# EAGLE design polargraph (EAGLE 9.3.0)
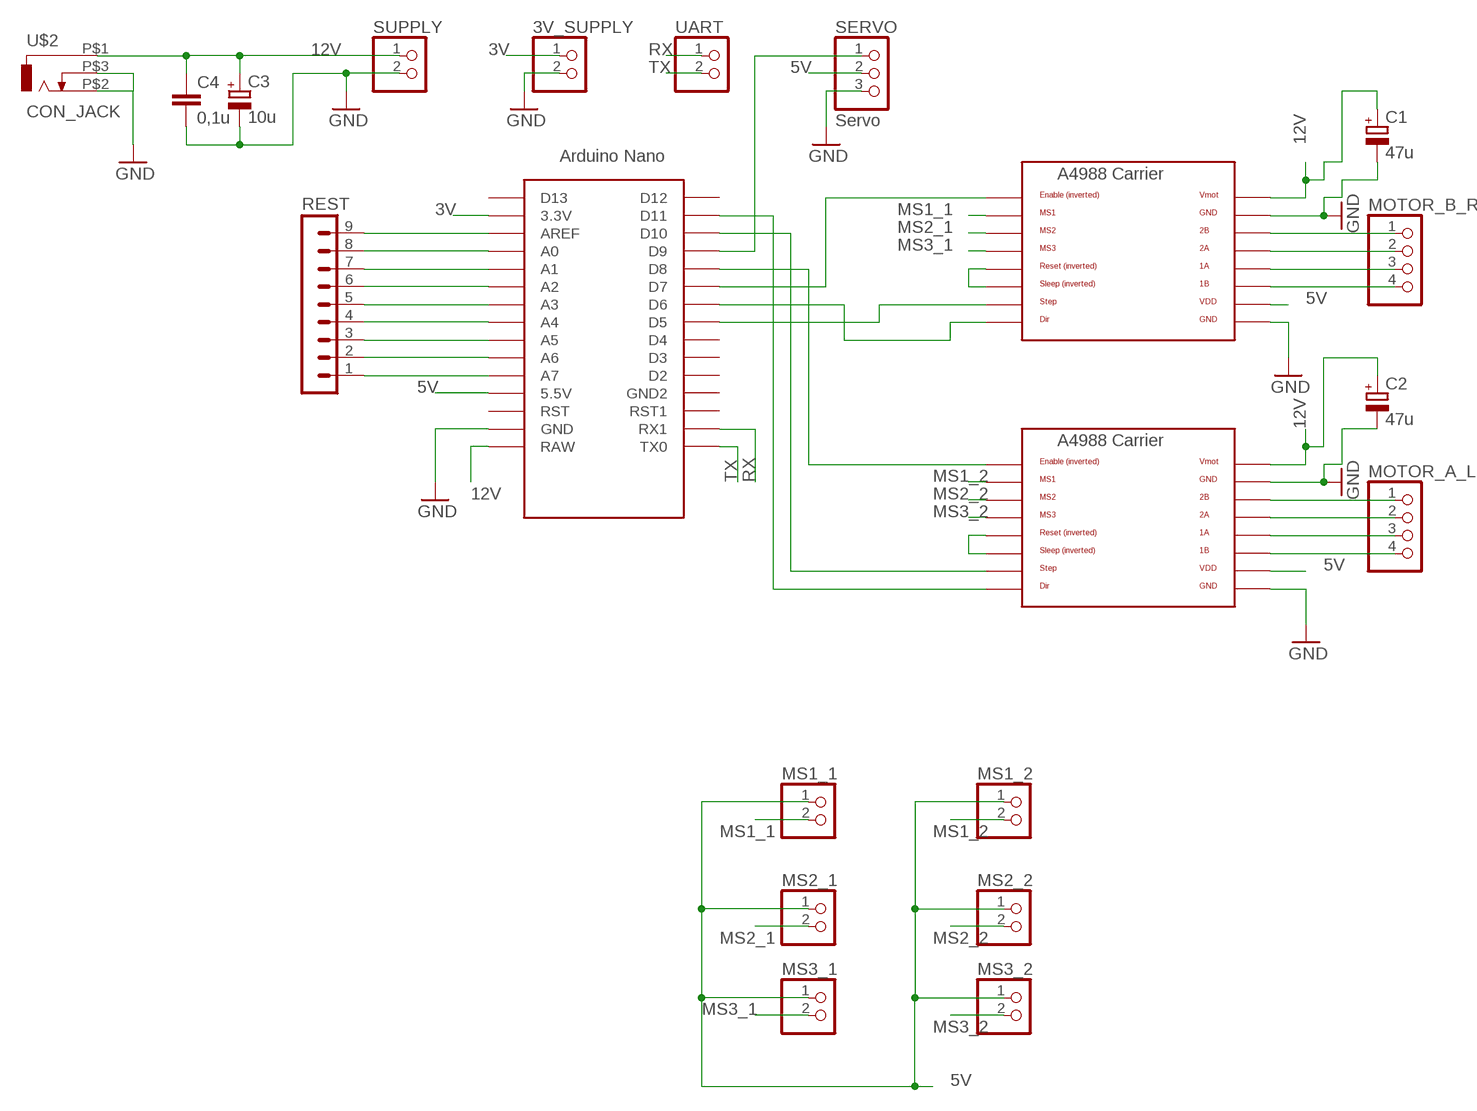
[diagram p0: schematic, sheet 1]

## Parts
3V_SUPPLY  PINHD-1X2  [1X02]
C1  47u  CPOL-EUE3.5-10  [E3,5-10]
C2  47u  CPOL-EUE3.5-10  [E3,5-10]
C3  10u  CPOL-EUE3.5-10  [E3,5-10]
C4  0,1u  C-EUC0805  [C0805]
DRIVER_LEFT  A4988BREAKOUT  [A4988BREAKOUT]
DRIVER_R  A4988BREAKOUT  [A4988BREAKOUT]
MOTOR_A_L  PINHD-1X4  [1X04]
MOTOR_B_R  PINHD-1X4  [1X04]
MS1_1  PINHD-1X2  [1X02]
MS1_2  PINHD-1X2  [1X02]
MS2_1  PINHD-1X2  [1X02]
MS2_2  PINHD-1X2  [1X02]
MS3_1  PINHD-1X2  [1X02]
MS3_2  PINHD-1X2  [1X02]
REST  MA09-1  [MA09-1]
SERVO  Servo  PINHD-1X3  [1X03]
SUPPLY  PINHD-1X2  [1X02]
U$1  NANO  [NANO]
U$2  CON_JACK  [CON_JACK]
UART  PINHD-1X2  [1X02]

## Nets
3V: 3V_SUPPLY.1 U$1.3.3V
5V: DRIVER_LEFT.VDD DRIVER_R.VDD MS1_1.1 MS1_2.1 MS2_1.1 MS2_2.1 MS3_1.1 MS3_2.1 SERVO.2 U$1.5V(5.5V)
12V: C1.+ C2.+ C3.+ C4.1 DRIVER_LEFT.VMOT DRIVER_R.VMOT SUPPLY.1 U$1.RAW U$2.P$1(V1)
GND: 3V_SUPPLY.2 C1.- C2.- C3.- C4.2 DRIVER_LEFT.GND DRIVER_LEFT.GND@0(GND) DRIVER_R.GND DRIVER_R.GND@0(GND) SERVO.3 SUPPLY.2 U$1.GND U$2.P$2(G3) U$2.P$3(G2)
MS1_1: DRIVER_R.MS1 MS1_1.2
MS1_2: DRIVER_LEFT.MS1 MS1_2.2
MS2_1: DRIVER_R.MS2 MS2_1.2
MS2_2: DRIVER_LEFT.MS2 MS2_2.2
MS3_1: DRIVER_R.MS3 MS3_1.2
MS3_2: DRIVER_LEFT.MS3 MS3_2.2
N$1: DRIVER_R.RST DRIVER_R.SLP(SLEEP)
N$2: DRIVER_LEFT.RST DRIVER_LEFT.SLP(SLEEP)
N$3: DRIVER_LEFT.2B MOTOR_A_L.1
N$4: DRIVER_LEFT.2A MOTOR_A_L.2
N$5: DRIVER_LEFT.1A MOTOR_A_L.3
N$6: DRIVER_LEFT.1B MOTOR_A_L.4
N$7: DRIVER_R.2B MOTOR_B_R.1
N$8: DRIVER_R.2A MOTOR_B_R.2
N$9: DRIVER_R.1A MOTOR_B_R.3
N$10: DRIVER_R.1B MOTOR_B_R.4
N$11: DRIVER_R.EN U$1.D7
N$12: DRIVER_R.STEP U$1.D5
N$13: DRIVER_R.DIR U$1.D6
N$14: DRIVER_LEFT.EN U$1.D8
N$15: DRIVER_LEFT.STEP U$1.D10
N$16: DRIVER_LEFT.DIR U$1.D11
N$17: SERVO.1 U$1.D9
N$18: REST.9 U$1.AREF
N$19: REST.8 U$1.A0
N$20: REST.7 U$1.A1
N$21: REST.6 U$1.A2
N$22: REST.5 U$1.A3
N$23: REST.4 U$1.A4
N$24: REST.3 U$1.A5
N$25: REST.2 U$1.A6
N$26: REST.1 U$1.A7
RX: U$1.RX1 UART.1
TX: U$1.TX0 UART.2
Unconnected: U$1.D2 U$1.D3 U$1.D4 U$1.D12 U$1.D13 U$1.GND1(GND2) U$1.ICSP1 U$1.ICSP2 U$1.ICSP3 U$1.ICSP4 U$1.ICSP5 U$1.ICSP6 U$1.RST U$1.RST1

## Library data of the parts
3V_SUPPLY MS1_1 MS1_2 MS2_1 MS2_2 MS3_1 MS3_2 SUPPLY UART = pinhead:PINHD-1X2: PIN HEADER
C1-C3 = rcl:CPOL-EU: POLARIZED CAPACITOR, European symbol; SPICEPREFIX: C
C4 = rcl:C-EU: CAPACITOR, European symbol; SPICEPREFIX: C
DRIVER_LEFT DRIVER_R = RepRapjr (1):A4988BREAKOUT
MOTOR_A_L MOTOR_B_R = pinhead:PINHD-1X4: PIN HEADER
REST = con-lstb:MA09-1: PIN HEADER; OC_FARNELL: unknown; OC_NEWARK: unknown
SERVO = pinhead:PINHD-1X3: PIN HEADER
U$1 = Arduino-clone:NANO: Arduino Nano
U$2 = JACK:CON_JACK

## Board
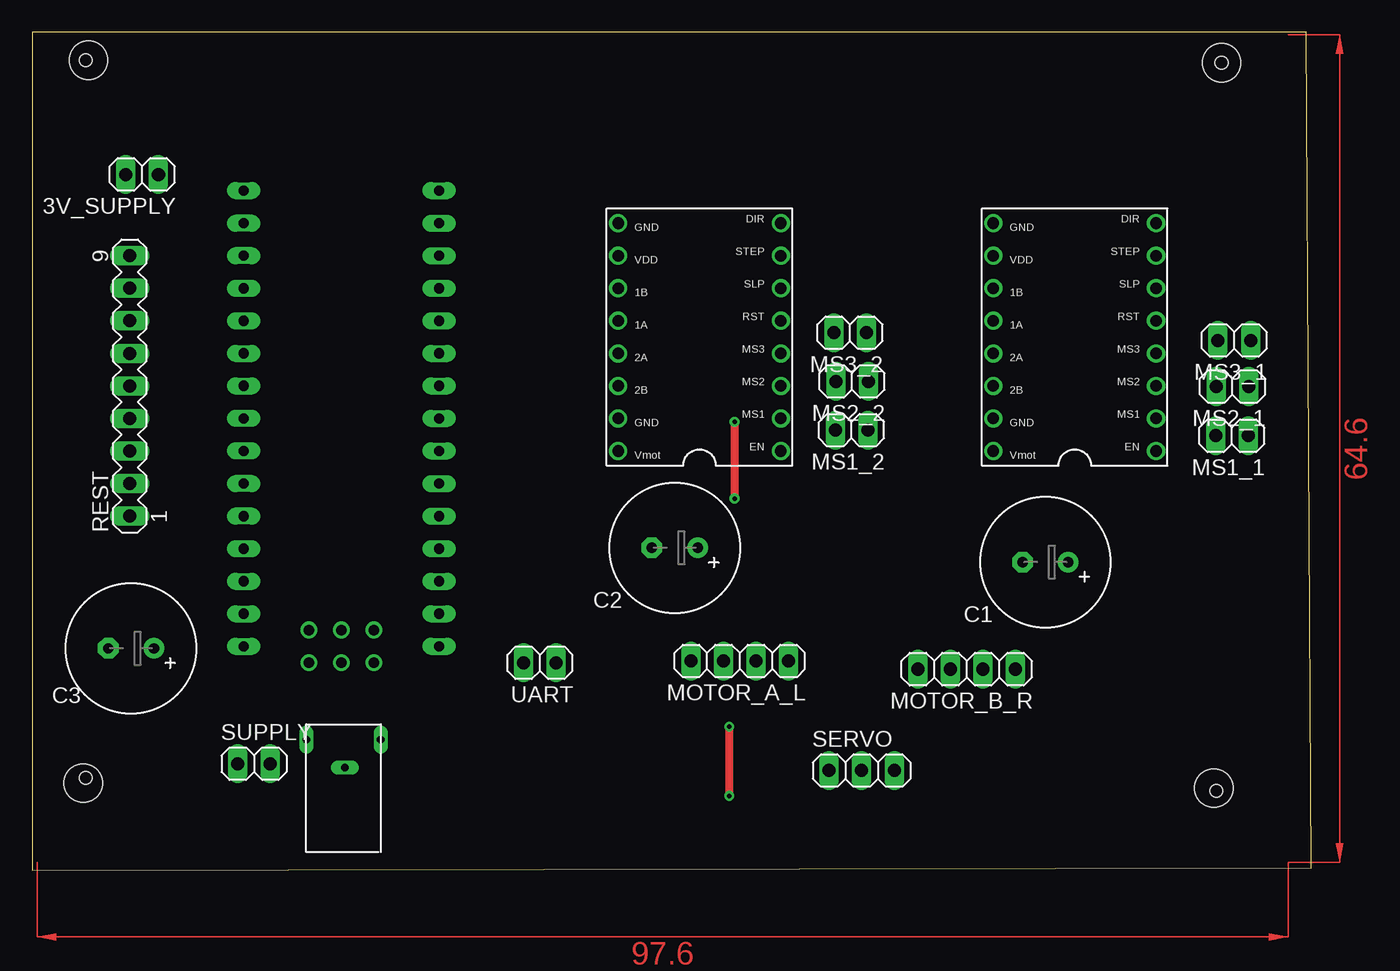
[diagram p1: board, top side]
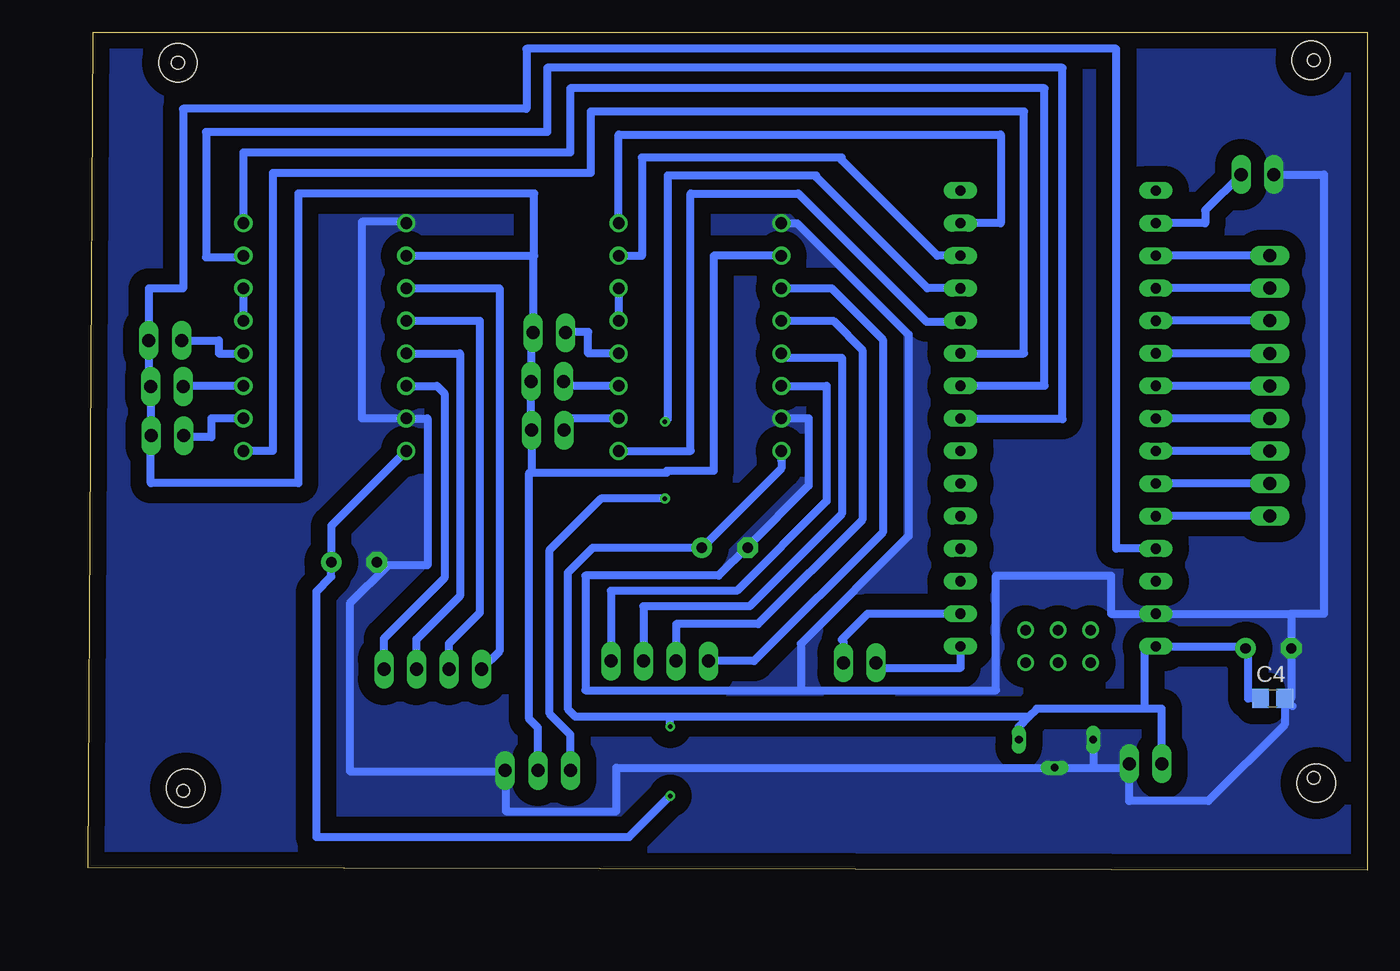
[diagram p2: board, bottom side, seen from below]

Size 99.8 x 65.4 mm. Coordinates in mm from the lower left corner, seen from the top.
Outline: 0,0 99.8,0.2 99.4,65.4 0,65.4 0,0
Copper layers (1*16): Top 0.035mm / dielectric 1.5mm / Bottom 0.035mm
Design rules "default": minimum track width 6mil, minimum drill 0.35mm, track to track 6mil, track to pad 6mil, pad to pad 6mil, via to via 6mil, smd to smd 6mil, copper to edge 40mil, drill to drill 6mil, minimum pad ring 10mil, minimum via ring 8mil, stop-mask expansion 4mil, vias tented up to drill 0mil, thermal gap 10mil
Holes 1 mm at 4.2,7.2 92.4,6.2 92.8,63 4.2,63.2
Holes 3 mm at 4.4,63.2 92.8,63 92.2,6.4 4,6.8

### Footprints (pad centres in the part's own frame; a part is rotated, then mirrored left to right if it is on the bottom)
1X02 = drill 1.016 long: 1 -1.27,0; 2 1.27,0
E3,5-10 = drill 0.813 pad 1.6: + -1.778,0 | drill 0.813 pad 1.6 octagon: - 1.778,0
C0805 = smd 1.3 x 1.5: 1 -0.95,0; 2 0.95,0
A4988BREAKOUT = drill 0.9: 1A 8.89,1.27; 1B 11.43,1.27; 2A 6.35,1.27; 2B 3.81,1.27; DIR 16.51,-11.43; EN -1.27,-11.43; GND 16.51,1.27; GND@0 1.27,1.27; MS1 1.27,-11.43; MS2 3.81,-11.43; MS3 6.35,-11.43; RST 8.89,-11.43; SLP 11.43,-11.43; STEP 13.97,-11.43; VDD 13.97,1.27; VMOT -1.27,1.27
1X04 = drill 1.016 long: 1 -3.81,0; 2 -1.27,0; 3 1.27,0; 4 3.81,0
MA09-1 = drill 1.016 long: 1 -10.16,0; 2 -7.62,0; 3 -5.08,0; 4 -2.54,0; 5 0,0; 6 2.54,0; 7 5.08,0; 8 7.62,0; 9 10.16,0
1X03 = drill 1.016 long: 1 -2.54,0; 2 0,0; 3 2.54,0
NANO = drill 0.8 long: 3.3V -10.16,24.13; 5V -10.16,-1.27; A0 -10.16,19.05; A1 -10.16,16.51; A2 -10.16,13.97; A3 -10.16,11.43; A4 -10.16,8.89; A5 -10.16,6.35; A6 -10.16,3.81; A7 -10.16,1.27; AREF -10.16,21.59; D2 5.08,1.27; D3 5.08,3.81; D4 5.08,6.35; D5 5.08,8.89; D6 5.08,11.43; D7 5.08,13.97; D8 5.08,16.51; D9 5.08,19.05; D10 5.08,21.59; D11 5.08,24.13; D12 5.08,26.67; D13 -10.16,26.67; GND -10.16,-6.35; GND1 5.08,-1.27; RAW -10.16,-8.89; RST -10.16,-3.81; RST1 5.08,-3.81; RX1 5.08,-6.35; TX0 5.08,-8.89 | drill 0.8: ICSP1 -5.08,-10.16; ICSP2 -5.08,-7.62; ICSP3 -2.54,-10.16; ICSP4 -2.54,-7.62; ICSP5 0,-10.16; ICSP6 0,-7.62
CON_JACK = drill 0.6 long: P$1 -2.2,0; P$2 3.6,0; P$3 0.6,2.2

### Placement (x,y rotation side)
3V_SUPPLY  8.59,54.29 180 top
C1  79.05,24.04 180 top
C2  50.14,25.15 180 top
C3  7.72,17.31 180 top
C4  7.4,13.4 0 bottom
DRIVER_LEFT  46.99,33.98 90 top
DRIVER_R  76.26,33.98 90 top
MOTOR_A_L  55.21,16.33 180 top
MOTOR_B_R  72.92,15.69 180 top
MS1_1  93.6,33.9 180 top
MS1_2  63.93,34.34 180 top
MS2_1  93.65,37.74 180 top
MS2_2  63.97,38.14 180 top
MS3_1  93.79,41.34 180 top
MS3_2  63.81,41.94 180 top
REST  7.62,37.79 90 top
SERVO  64.72,7.78 0 top
SUPPLY  17.32,8.31 0 top
U$1  26.67,26.36 0 top
U$2  25,10.2 180 top
UART  39.62,16.18 180 top

### Tracks (layer width: path | path; a pad name or v marks a point on that pad's centre or on a via)
3V
  Bottom 0.61: 3V_SUPPLY.1 12.66,51.49 12.66,50.49 U$1.3.3V
5V
  Bottom 0.61: 94.92,33.9 MS2_1.1 95.06,37.74 MS3_1.1 95.06,45.4 92.4,45.4 92.4,59.4 65.6,59.4 65.6,64.08 19.6,64.08 19.6,25.09 U$1.5V | 94.92,33.9 MS1_1.1 | 65.2,31 MS1_2.1 65.24,34.34 MS2_2.1 65.24,41.94 MS3_2.1 65.08,47.95 DRIVER_R.VDD 65,47.95 65,52.8 83.4,52.8 83.4,30.2 94.92,30.2 94.92,33.9 | 65.2,31 54.68,31 54.68,31.16 51,31.16 51,47.95 DRIVER_LEFT.VDD | 65.2,31 65.4,31 65.4,11.8 64.72,11.12 SERVO.2
12V  (via drill 0.35)
  Top 0.61: v54.4,5.8 v54.4,11.2
  Bottom 0.61: 9.5,17.47 U$1.RAW 17.4,17.47 17.4,12.6 | 9.5,17.47 C3.+ | C4.1 9.3,13.4 9.3,17.27 9.5,17.47 | DRIVER_LEFT.VMOT 45.72,32 45.72,31.35 C2.+ 60.45,25.15 62.4,23.2 62.4,12.6 61.8,12 54.4,12 | 17.4,12.6 25.8,12.6 26.4,12 | 54.4,12 26.4,12 | v54.4,5.8 57.6,2.6 82,2.6 82,21.73 80.83,22.9 C1.+ 80.83,26.87 DRIVER_R.VMOT 75.02,32.74 | v54.4,11.2 54.4,12 | SUPPLY.1 16.05,12.6 17.4,12.6 | 26.4,12 27.2,11.2 U$2.P$1
GND
  Bottom 0.61: 5.74,20 5.74,20.01 U$1.GND 20,20.01 20,23 28.98,23 28.98,14.04 44.2,14.04 | C4.2 5.94,13.4 C3.- 5.94,20 5.74,20 | 5.85,12.8 C4.2 | 3V_SUPPLY.2 3.4,54.29 3.4,20 5.74,20 | DRIVER_LEFT.GND@0 43.6,35.25 43.6,30 48.36,25.24 | DRIVER_R.GND 74.99,50.6 78.44,50.6 78.44,35.25 DRIVER_R.GND@0 73.33,35.25 73.33,23.78 76.93,23.78 | C2.- 48.36,25.24 | 44.2,14.04 61,14.04 61,22.99 50.61,22.99 48.36,25.24 | 67.2,7.72 67.2,4.6 58.6,4.6 58.6,8 U$2.P$3 21.4,8 | 67.2,7.72 SERVO.3 | DRIVER_LEFT.GND 44.49,50.49 35.8,41.8 35.8,26.08 44.2,17.68 44.2,14.04 | 67.2,7.72 79.4,7.72 79.4,20.8 76.42,23.78 77.01,23.78 C1.- | 21.4,8 18.9,8 SUPPLY.2 18.59,5.4 12.4,5.4 6.45,11.35 C4.2 | U$2.P$2 21.4,8
  pour Bottom (isolate 1.27, no thermals): 99.2,65.2 99,0.8 0.4,0.8 0.4,65
MS1_1
  Bottom 0.61: DRIVER_R.MS1 90.2,35.25 90.2,33.8 92.33,33.8 MS1_1.2
MS1_2
  Bottom 0.61: DRIVER_LEFT.MS1 63,35.25 | 63,35.25 63,35.4 | 63,35.25 63,34.34 MS1_2.2
MS2_1
  Bottom 0.61: DRIVER_R.MS2 92.38,37.79 MS2_1.2
MS2_2
  Bottom 0.61: DRIVER_LEFT.MS2 62.7,37.79 MS2_2.2
MS3_1
  Bottom 0.61: MS3_1.2 89.6,41.34 89.6,40.33 DRIVER_R.MS3
MS3_2
  Bottom 0.61: DRIVER_LEFT.MS3 60.8,40.33 60.8,42 62.54,42 MS3_2.2
N$1
  Bottom 0.61: DRIVER_R.SLP DRIVER_R.RST
N$2
  Bottom 0.61: DRIVER_LEFT.SLP DRIVER_LEFT.RST
N$3
  Bottom 0.61: DRIVER_LEFT.2B 42.2,37.79 42.2,28.8 49.2,21.8 59.02,21.8 MOTOR_A_L.1
N$4
  Bottom 0.61: DRIVER_LEFT.2A 45.72,40 41,40 41,27.8 48.2,20.6 56.48,20.6 MOTOR_A_L.2
N$5
  Bottom 0.61: MOTOR_A_L.3 53.94,19.2 47.53,19.2 39.4,27.33 39.4,40.6 41.67,42.87 DRIVER_LEFT.1A
N$6
  Bottom 0.61: DRIVER_LEFT.1B 41.81,45.41 37.8,41.4 37.8,26.37 47.84,16.33 MOTOR_A_L.4
N$7
  Bottom 0.61: DRIVER_R.2B 72.59,37.79 72,37.2 72,22.8 76.73,18.07 MOTOR_B_R.1
N$8
  Bottom 0.61: DRIVER_R.2A 70.8,40.33 70.8,21.4 74.19,18.01 MOTOR_B_R.2
N$9
  Bottom 0.61: DRIVER_R.1A 69.25,42.87 69.25,20.09 71.65,17.69 MOTOR_B_R.3
N$10
  Bottom 0.61: DRIVER_R.1B 67.71,45.41 67.71,17.09 MOTOR_B_R.4
N$11
  Bottom 0.61: U$1.D7 26.8,40.33 26.8,59.2 60.6,59.2 60.6,54.4 85.4,54.4 85.4,32.71 DRIVER_R.EN
N$12
  Bottom 0.61: DRIVER_R.STEP 87.81,47.83 90.6,47.83 90.6,57.6 64,57.6 64,62.6 23.8,62.6 23.8,35.2 31.75,35.2 U$1.D5
N$13
  Bottom 0.61: U$1.D6 25.2,37.79 25.2,61 62.2,61 62.2,56 87.69,56 DRIVER_R.DIR
N$14
  Bottom 0.61: DRIVER_LEFT.EN 52.8,32.71 52.8,52.8 44.4,52.8 34.4,42.8 31.82,42.8 U$1.D8
N$15
  Bottom 0.61: DRIVER_LEFT.STEP 56.6,47.95 56.6,55.6 41,55.6 41,55.4 33.55,47.95 U$1.D10
N$16
  Bottom 0.61: DRIVER_LEFT.DIR 58.42,57.4 28.6,57.4 28.6,50.49 U$1.D11
N$17  (via drill 0.35)
  Top 0.61: v54.8,35 v54.8,29
  Bottom 0.61: SERVO.1 62.18,10.58 63.8,12.2 63.8,25 59.8,29 v54.8,29 | U$1.D9 34.34,45.41 43,54.07 43,54.2 54.6,54.2 54.6,35.2 v54.8,35
N$18
  Bottom 0.61: REST.9 U$1.AREF
N$19
  Bottom 0.61: REST.8 U$1.A0
N$20
  Bottom 0.61: REST.7 U$1.A1
N$21
  Bottom 0.61: REST.6 U$1.A2
N$22
  Bottom 0.61: REST.5 U$1.A3
N$23
  Bottom 0.61: REST.4 U$1.A4
N$24
  Bottom 0.61: REST.3 U$1.A5
N$25
  Bottom 0.61: REST.2 U$1.A6
N$26
  Bottom 0.61: REST.1 U$1.A7
RX
  Bottom 0.61: U$1.RX1 38.99,20.01 41,18 40.89,17.89 UART.1
TX
  Bottom 0.61: U$1.TX0 31.75,15.8 38.21,15.8 38.21,16.04 UART.2
(copper drawn outside any net)
  shapes: Top area x2